# EAGLE design schematic (EAGLE 9.5.1)
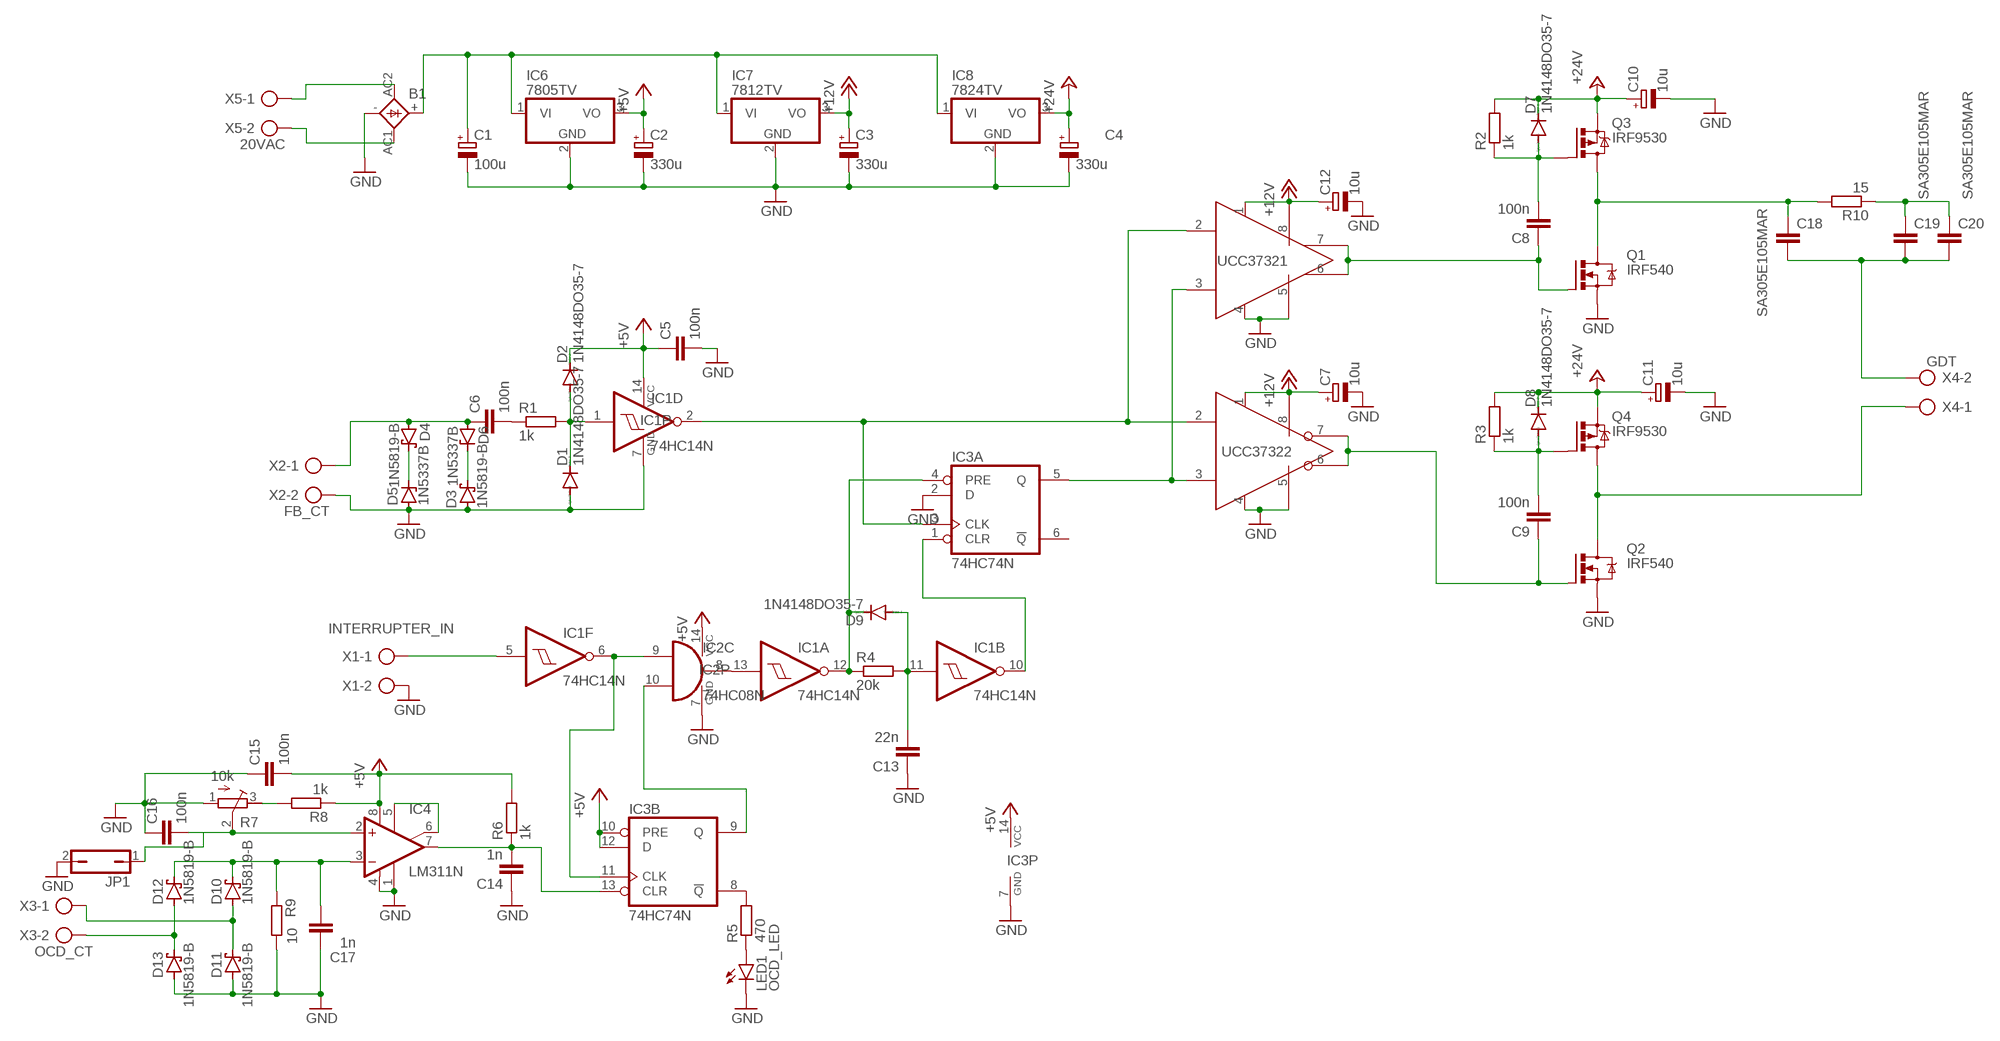
[diagram p0: schematic, sheet 1]

## Parts
B1  KBL  [KBL]
C1  100u  CPOL-EUE3.5-10  [E3,5-10]
C2  330u  CPOL-EUE3.5-10  [E3,5-10]
C3  330u  CPOL-EUE3.5-10  [E3,5-10]
C4  330u  CPOL-EUE3.5-10  [E3,5-10]
C5  100n  C-EU050-030X075  [C050-030X075]
C6  100n  C-EU050-030X075  [C050-030X075]
C7  10u  CPOL-EUE2.5-6  [E2,5-6]
C8  100n  C-EU050-030X075  [C050-030X075]
C9  100n  C-EU050-030X075  [C050-030X075]
C10  10u  CPOL-EUE2.5-6  [E2,5-6]
C11  10u  CPOL-EUE2.5-6  [E2,5-6]
C12  10u  CPOL-EUE2.5-6  [E2,5-6]
C13  22n  C-EU050-030X075  [C050-030X075]
C14  1n  C-EU050-030X075  [C050-030X075]
C15  100n  C-EU050-030X075  [C050-030X075]
C16  100n  C-EU050-030X075  [C050-030X075]
C17  1n  C-EU050-030X075  [C050-030X075]
C18  SA305E105MAR  C-EU050-025X075  [C050-025X075]
C19  SA305E105MAR  C-EU050-025X075  [C050-025X075]
C20  SA305E105MAR  C-EU050-025X075  [C050-025X075]
D1  1N4148DO35-7  [DO35-7]
D2  1N4148DO35-7  [DO35-7]
D3  1N5819-B  [DO41-7.6]
D4  1N5819-B  [DO41-7.6]
D5  1N5337B  ZENER-DIODEDO41Z10  [DO41Z10]
D6  1N5337B  ZENER-DIODEDO41Z10  [DO41Z10]
D7  1N4148DO35-7  [DO35-7]
D8  1N4148DO35-7  [DO35-7]
D9  1N4148DO35-7  [DO35-7]
D10  1N5819-B  [DO41-7.6]
D11  1N5819-B  [DO41-7.6]
D12  1N5819-B  [DO41-7.6]
D13  1N5819-B  [DO41-7.6]
IC1  74HC14N  [DIL14]
IC2  74HC08N  [DIL14]
IC3  74HC74N  [DIL14]
IC4  LM311N  [DIL08]
IC5  UCC37321DIL8  [DIL08]
IC6  7805TV  [TO220V]
IC7  7812TV  [TO220V]
IC8  7824TV  [TO220V]
IC9  UCC37322DIL8  [DIL08]
JP1  JP1Q  [JP1]
LED1  OCD_LED  LED3MM  [LED3MM]
Q1  IRF540  [TO220BV]
Q2  IRF540  [TO220BV]
Q3  IRF9530  [TO220BV]
Q4  IRF9530  [TO220BV]
R1  1k  R-EU_0204/7  [0204/7]
R2  1k  R-EU_0204/7  [0204/7]
R3  1k  R-EU_0204/7  [0204/7]
R4  20k  R-EU_0204/7  [0204/7]
R5  470  R-EU_0204/7  [0204/7]
R6  1k  R-EU_0204/7  [0204/7]
R7  10k  R-TRIMM64X  [RTRIM64X]
R8  1k  R-EU_0204/7  [0204/7]
R9  10  R-EU_0411/15  [0411/15]
R10  15  R-EU_0204/7  [0204/7]
X1  INTERRUPTER_IN  AK300/2  [AK300/2]
X2  FB_CT  AK300/2  [AK300/2]
X3  OCD_CT  AK300/2  [AK300/2]
X4  GDT  AK300/2  [AK300/2]
X5  20VAC  AK300/2  [AK300/2]

## Nets
+5V: C2.+ C5.1 C15.2 D2.C IC1.14(P:VCC) IC2.14(P:VCC) IC3.10(B:PRE) IC3.12(B:D) IC3.14(P:VCC) IC4.8(V+) IC6.3(VO) R6.2 R8.1
+12V: C3.+ C7.+ C12.+ IC5.1(1_VDD) IC5.8(8_VDD) IC7.3(VO) IC9.1(1_VDD) IC9.8(8_VDD)
+24V: C4.+ C10.+ C11.+ D7.C D8.C IC8.3(VO) Q3.S Q4.S R2.2 R3.2
GND: B1.- C1.- C2.- C3.- C4.- C5.2 C7.- C10.- C11.- C12.- C13.1 C14.1 C15.1 C16.1 C17.1 D1.A D3.A D5.A D11.A D13.A IC1.7(P:GND) IC2.7(P:GND) IC3.2(A:D) IC3.7(P:GND) IC4.1(GND) IC4.4(V-) IC5.4(4_AGND) IC5.5(5_PGND) IC6.2(GND) IC7.2(GND) IC8.2(GND) IC9.4(4_AGND) IC9.5(5_PGND) JP1.2 LED1.K(C) Q1.S Q2.S R7.1(A) R9.2 X1.2 X2.2
N$1: B1.+ C1.+ IC6.1(VI) IC7.1(VI) IC8.1(VI)
N$2: B1.AC2(AC1) X5.1
N$3: B1.AC1(AC2) X5.2
N$4: D1.C D2.A IC1.1(D:I) R1.2
N$5: C6.2 R1.1
N$6: C6.1 D4.A D6.A X2.1
N$7: D3.C D6.C
N$8: D4.C D5.C
N$9: IC1.2(D:O) IC3.3(A:CLK) IC5.2(2_IN) IC9.2(2_IN)
N$10: C8.1 IC5.6(6_OUT) IC5.7(7_OUT) Q1.G
N$11: IC3.5(A:Q) IC5.3(3_ENBL) IC9.3(3_ENBL)
N$12: C9.1 IC9.6(6_OUT) IC9.7(7_OUT) Q2.G
N$13: IC1.10(B:O) IC3.1(A:CLR)
N$14: C9.2 D8.A Q4.G R3.1
N$15: D9.C IC1.12(A:O) IC3.4(A:PRE) R4.1
N$16: C13.2 D9.A IC1.11(B:I) R4.2
N$17: C8.2 D7.A Q3.G R2.1
N$18: Q2.D Q4.D X4.1
N$19: C18.1 Q1.D Q3.D R10.2
N$20: IC1.13(A:I) IC2.8(C:O)
N$21: C19.1 C20.1 R10.1
N$22: IC2.10(C:I1) IC3.9(B:Q)
N$23: IC3.8(B:!Q) R5.2
N$24: LED1.A R5.1
N$25: IC1.6(F:O) IC2.9(C:I0) IC3.11(B:CLK)
N$26: IC4.5(ON) IC4.6(ON/STR)
N$27: C16.2 IC4.2(+IN) JP1.1 R7.2(S)
N$28: R7.3(E) R8.2
N$29: C17.2 D10.C D12.C IC4.3(-IN) R9.1
N$30: C14.2 IC3.13(B:CLR) IC4.7(OUT) R6.1
N$31: D10.A D11.C X3.1
N$32: D12.A D13.C X3.2
N$33: C18.2 C19.2 C20.2 X4.2
N$34: IC1.5(F:I) X1.1
Unconnected: IC1.3(E:I) IC1.4(E:O) IC1.8(C:O) IC1.9(C:I) IC2.1(A:I0) IC2.2(A:I1) IC2.3(A:O) IC2.4(B:I0) IC2.5(B:I1) IC2.6(B:O) IC2.11(D:O) IC2.12(D:I0) IC2.13(D:I1) IC3.6(A:!Q)

## Library data of the parts
B1 = rectifier:KBL: DIOTEC RECTIFIER
C1-C4 C7 C10-C12 = resistor:CPOL-EU: POLARIZED CAPACITOR, European symbol
C5 C6 C8 C9 C13-C17 = rcl:C-EU: CAPACITOR, European symbol; SPICEPREFIX: C
C18-C20 = resistor:C-EU: CAPACITOR, European symbol
D1 D2 D7-D9 = diode:1N4148: DIODE high speed (Philips)
D3 D4 D10-D13 = diode:1N581*: 1.0A SCHOTTKY BARRIER RECTIFIER Source: http://www.diodes.com/datasheets/ds23001.pdf
D5 D6 = diode:ZENER-DIODE: Z-Diode
IC1 = 74xx-eu:74*14: Hex schmitt trigger INVERTER
IC2 = 74xx-eu:74*08: Quad 2-input AND gate
IC3 = 74xx-eu:74*74: Dual D type positive edge triggered FLIP FLOP, preset and clear
IC4 = linear:LM311: COMPARATOR
IC5 = UCC37321:UCC37321: NonInverting 9A Mosfet Gate Diver with Enable; AVAILABILITY: Unavailable; DESCRIPTION: Low-Side Gate Driver IC Inverting 8-PDIP; MF: Texas Instruments; MP: UCC37321; PACKAGE: SOIC-8 Texas Instruments; PRICE: None
IC6-IC8 = linear:78*: Positive VOLTAGE REGULATOR Source: http://cache.national.com/ds/LM/LM78L05.pdf http://www.fairchildsemi.com/ds/LM/LM7805.pdf
IC9 = UCC37322:UCC37322: Inverting 9A Mosfet Gate Diver with Enable; AVAILABILITY: Unavailable; DESCRIPTION: Low-Side Gate Driver IC Non-Inverting 8-PDIP; MF: Texas Instruments; MP: UCC37322; PACKAGE: SOIC-8 Texas Instruments; PRICE: None
JP1 = jumper:JP1Q: JUMPER
LED1 = led:LED: LED OSRAM: - CHIPLED LG R971, LG N971, LY N971, LG Q971, LY Q971, LO R971, LY R971 LH N974, LH R974 LS Q976, LO Q976, LY Q976 LO Q996 - Hyper CHIPLED LW Q18S LB Q993, LB Q99A, LB R99A - SideLED LS A670, LO A670, LY A670, LG A670, LP A670 LB A673, LV A673, LT A673, LW A673 LH A674 LY A675 LS A676, LA A676, LO A676, LY A676, LW A676 LS A679, LY A679, LG A679 - Hyper Micro SIDELED® LS Y876, LA Y876, LO Y876, LY Y876 LT Y87S - SmartLED LW L88C, LW L88S LB L89C, LB L89S, LG L890 LS L89K, LO L89K, LY L89K LS L896, LA L896, LO L896, LY L896 - TOPLED LS T670, LO T670, LY T670, LG T670, LP T670 LSG T670, LSP T670, LSY T670, LOP T670, LYG T670 LG T671, LOG T671, LSG T671 LB T673, LV T673, LT T673, LW T673 LH T674 LS T676, LA T676, LO T676, LY T676, LB T676, LH T676, LSB T676, LW T676 LB T67C, LV T67C, LT T67C, LS T67K, LO T67K, LY T67K, LW E67C LS E67B, LA E67B, LO E67B, LY E67B, LB E67C, LV E67C, LT E67C LW T67C LS T679, LY T679, LG T679 LS T770, LO T770, LY T770, LG T770, LP T770 LB T773, LV T773, LT T773, LW T773 LH T774 LS E675, LA E675, LY E675, LS T675 LS T776, LA T776, LO T776, LY T776, LB T776 LHGB T686 LT T68C, LB T68C - Hyper Mini TOPLED® LB M676 - Mini TOPLED Santana® LG M470 LS M47K, LO M47K, LY M47K Source: http://www.osram.convergy.de LUXEON: - LUMILED® LXK2-PW12-R00, LXK2-PW12-S00, LXK2-PW14-U00, LXK2-PW14-V00 LXK2-PM12-R00, LXK2-PM12-S00, LXK2-PM14-U00 LXK2-PE12-Q00, LXK2-PE12-R00, LXK2-PE12-S00, LXK2-PE14-T00, LXK2-PE14-U00 LXK2-PB12-K00, LXK2-PB12-L00, LXK2-PB12-M00, LXK2-PB14-N00, LXK2-PB14-P00, LXK2-PB14-Q00 LXK2-PR12-L00, LXK2-PR12-M00, LXK2-PR14-Q00, LXK2-PR14-R00 LXK2-PD12-Q00, LXK2-PD12-R00, LXK2-PD12-S00 LXK2-PH12-R00, LXK2-PH12-S00 LXK2-PL12-P00, LXK2-PL12-Q00, LXK2-PL12-R00 Source: www.luxeon.com KINGBRIGHT: KA-3528ASYC Source: www.kingbright.com
Q1 Q2 = transistor-power:IRF540: HEXFET Power MOSFET
Q3 Q4 = transistor-power:IRF9530: P-CHANNEL HEXFET POWER-MOS-FET Source: http://www.irf.com/product-info/datasheets/data/irf9530.pdf
R1-R6 R8-R10 = resistor:R-EU_: RESISTOR, European symbol
R7 = resistor:R-TRIMM: Trimm resistor
X1-X5 = con-ptr500:AK300/2: CONNECTOR; OC_FARNELL: unknown; OC_NEWARK: unknown

## Board
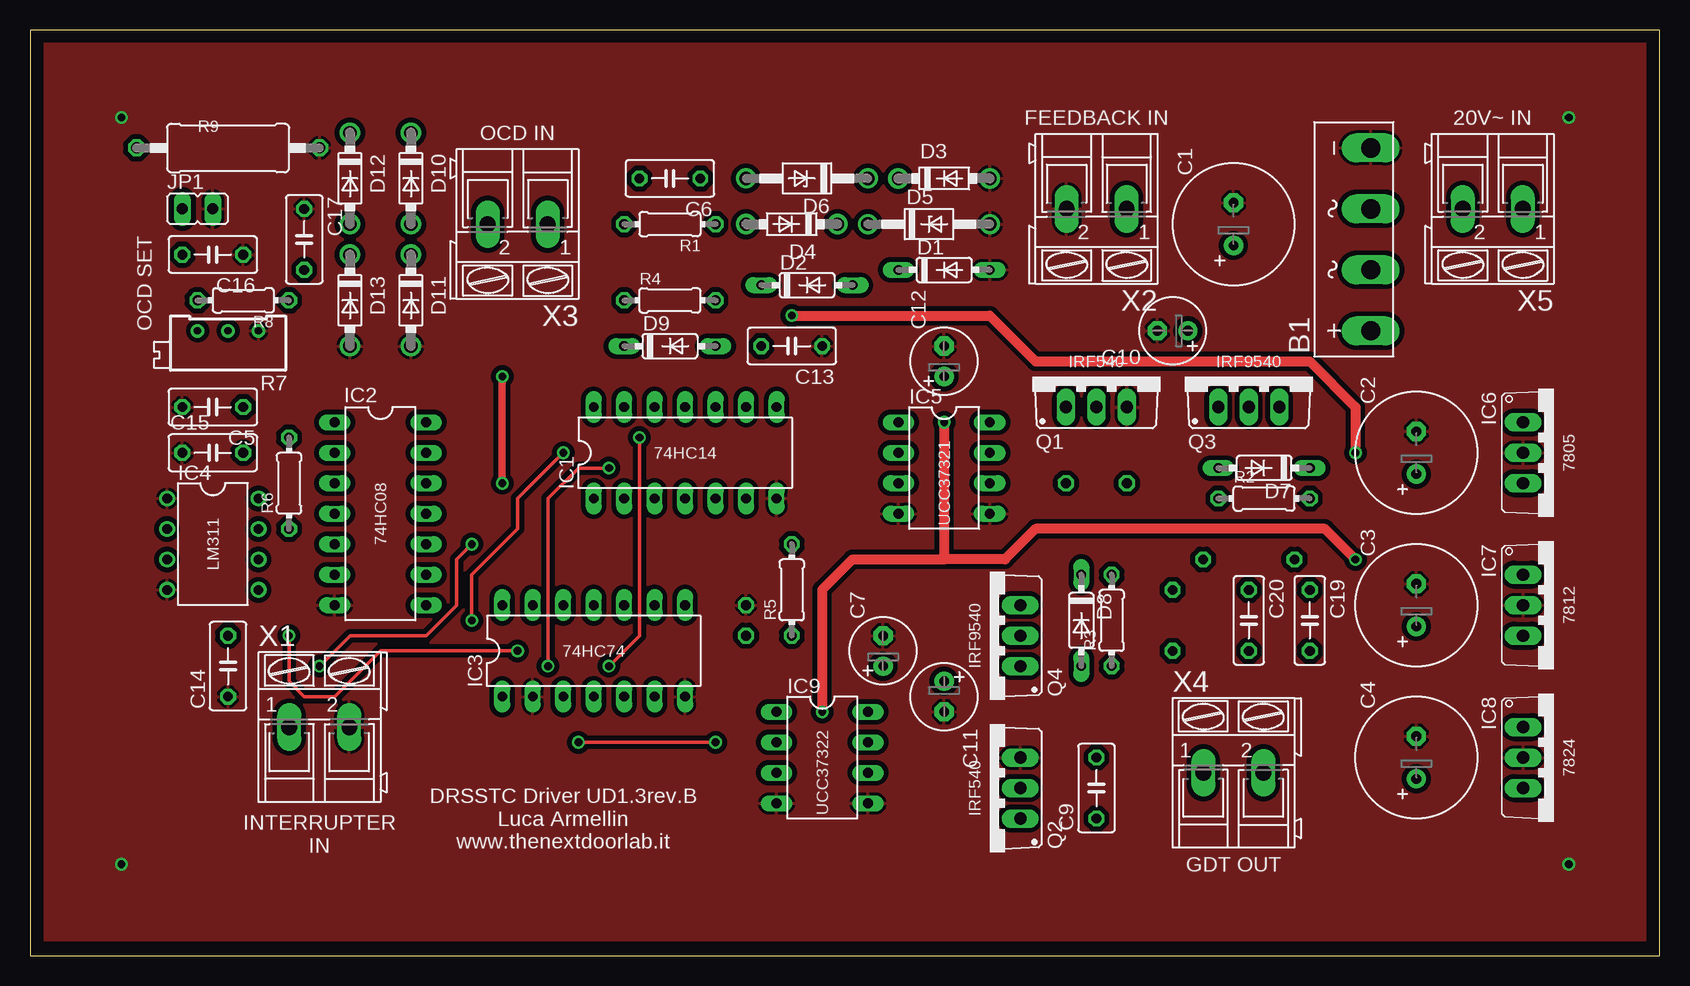
[diagram p1: board, top side]
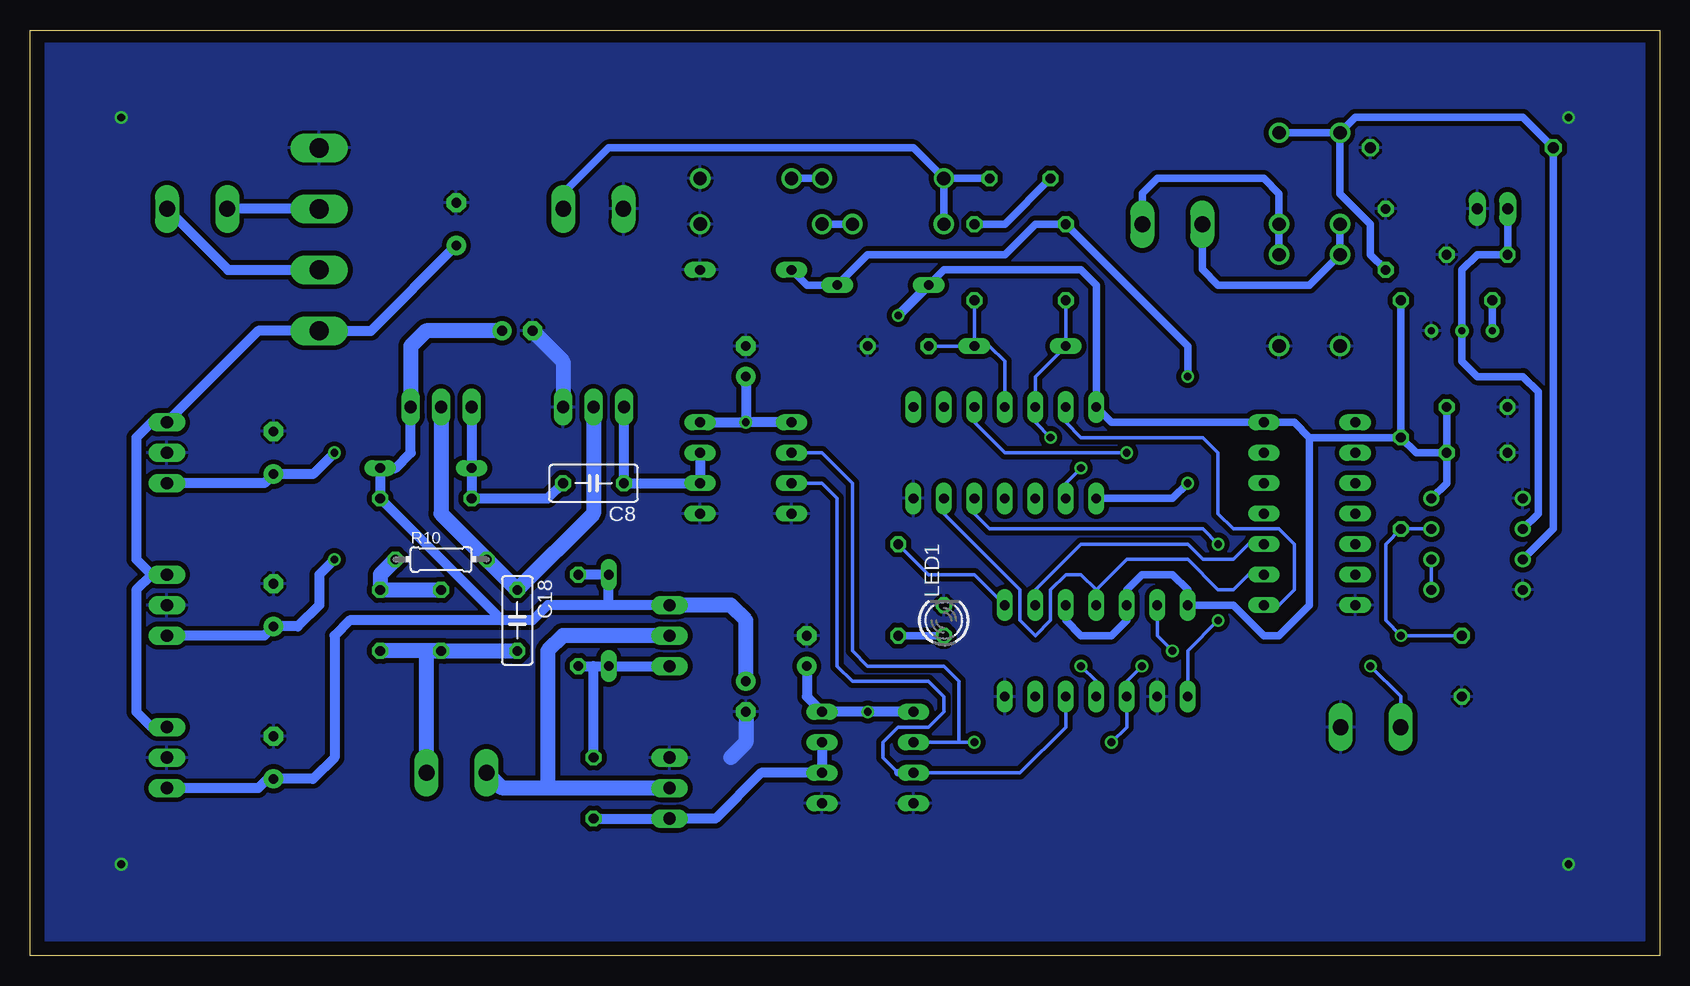
[diagram p2: board, bottom side, seen from below]

Size 135.87 x 77.14 mm. Coordinates in mm from the lower left corner, seen from the top.
Outline: 0,0 135.87,0 135.87,77.14 0,77.14 0,0
Copper layers (1*16): Top 0.035mm / dielectric 1.5mm / Bottom 0.035mm
Design rules "default": minimum track width 6mil, minimum drill 0.35mm, track to track 6mil, track to pad 6mil, pad to pad 6mil, via to via 6mil, smd to smd 6mil, copper to edge 40mil, drill to drill 6mil, minimum pad ring 10mil, minimum via ring 8mil, stop-mask expansion 4mil, vias tented up to drill 0mil, thermal gap 10mil

### Footprints (pad centres in the part's own frame; a part is rotated, then mirrored left to right if it is on the bottom)
KBL = drill 1.6 long: + -7.62,-1.27; - 7.62,-1.27; AC1 2.54,-1.27; AC2 -2.54,-1.27
E3,5-10 = drill 0.813 pad 1.6: + -1.778,0 | drill 0.813 pad 1.6 octagon: - 1.778,0
C050-030X075 = drill 0.813 octagon: 1 -2.54,0; 2 2.54,0
E2,5-6 = drill 0.813 pad 1.6: + -1.27,0 | drill 0.813 pad 1.6 octagon: - 1.27,0
C050-025X075 = drill 0.813 octagon: 1 -2.54,0; 2 2.54,0
DO35-7 = drill 0.813 long: A 3.81,0; C -3.81,0
DO41-7.6 = drill 1.1 pad 1.7: A 3.81,0; C -3.81,0
DO41Z10 = drill 1.118: A 5.08,0; C -5.08,0
DIL14 = drill 0.813 long: 1 -7.62,-3.81; 2 -5.08,-3.81; 3 -2.54,-3.81; 4 0,-3.81; 5 2.54,-3.81; 6 5.08,-3.81; 7 7.62,-3.81; 8 7.62,3.81; 9 5.08,3.81; 10 2.54,3.81; 11 0,3.81; 12 -2.54,3.81; 13 -5.08,3.81; 14 -7.62,3.81
DIL08 = drill 0.813 pad 1.27: 1 -3.81,-3.81; 2 -1.27,-3.81; 3 1.27,-3.81; 4 3.81,-3.81; 5 3.81,3.81; 6 1.27,3.81; 7 -1.27,3.81; 8 -3.81,3.81
DIL08' = drill 0.813 long: 1 -3.81,-3.81; 2 -1.27,-3.81; 3 1.27,-3.81; 4 3.81,-3.81; 5 3.81,3.81; 6 1.27,3.81; 7 -1.27,3.81; 8 -3.81,3.81
TO220V = drill 1.016 long: 1 -2.54,-2.54; 2 0,-2.54; 3 2.54,-2.54
JP1 = drill 0.914 long: 1 0,-1.27; 2 0,1.27
LED3MM = drill 0.813 octagon: A -1.27,0; K 1.27,0
TO220BV = drill 1.016 long: D 0,-2.54; G -2.54,-2.54; S 2.54,-2.54
0204/7 = drill 0.813 octagon: 1 -3.81,0; 2 3.81,0
RTRIM64X = drill 0.61: 1 1.27,-2.54; 2 1.27,0; 3 1.27,2.54
0411/15 = drill 0.914 octagon: 1 -7.62,0; 2 7.62,0
AK300/2 = drill 1.321 long: 1 -2.515,0; 2 2.489,0

### Placement (x,y rotation side)
B1  110.49,59.69 90 top
C1  100.33,60.96 90 top
C2  115.57,41.91 90 top
C3  115.57,29.21 90 top
C4  115.57,16.51 90 top
C5  15.24,45.72 180 top
C6  53.34,64.77 180 top
C7  71.12,25.4 90 top
C8  88.9,39.37 180 bottom
C9  88.9,13.97 90 top
C10  95.25,52.07 180 top
C11  76.2,21.59 270 top
C12  76.2,49.53 90 top
C13  63.5,50.8 180 top
C14  16.51,24.13 90 top
C15  15.24,41.91 0 top
C16  15.24,58.42 180 top
C17  22.86,59.69 270 top
C18  95.25,27.94 270 bottom
C19  106.68,27.94 270 top
C20  101.6,27.94 270 top
D1  76.2,57.15 0 top
D2  64.77,55.88 0 top
D3  76.2,64.77 0 top
D4  63.5,60.96 180 top
D5  74.93,60.96 0 top
D6  64.77,64.77 180 top
D7  102.87,40.64 180 top
D8  87.63,27.94 270 top
D9  53.34,50.8 0 top
D10  31.75,64.77 270 top
D11  31.75,54.61 270 top
D12  26.67,64.77 270 top
D13  26.67,54.61 270 top
IC1  54.61,41.91 0 top
IC2  29.21,36.83 270 top
IC3  46.99,25.4 0 top
IC4  15.24,34.29 270 top
IC5  UCC37321DIL8  [DIL08']  76.2,40.64 270 top
IC6  127,41.91 270 top
IC7  127,29.21 270 top
IC8  127,16.51 270 top
IC9  UCC37322DIL8  [DIL08']  66.04,16.51 270 top
JP1  13.97,62.23 270 top
LED1  59.69,27.94 90 bottom
Q1  88.9,48.26 0 top
Q2  80.01,13.97 90 top
Q3  101.6,48.26 0 top
Q4  80.01,26.67 90 top
R1  53.34,60.96 180 top
R2  102.87,38.1 0 top
R3  90.17,27.94 90 top
R4  53.34,54.61 0 top
R5  63.5,30.48 90 top
R6  21.59,39.37 90 top
R7  16.51,50.8 90 top
R8  17.78,54.61 180 top
R9  16.51,67.31 0 top
R10  101.6,33.02 0 bottom
X1  24.13,19.05 0 top
X2  88.9,62.23 180 top
X3  40.64,60.96 180 top
X4  100.33,15.24 0 top
X5  121.92,62.23 180 top

### Tracks (layer width: path | path; a pad name or v marks a point on that pad's centre or on a via)
+5V  (via drill 0.65)
  Top 0.813: v63.5,53.34 80.01,53.34 83.82,49.53 106.68,49.53 110.49,45.72 v110.49,41.91
  Bottom 0.61: IC3.10 49.53,27.94 48.26,26.67 45.72,26.67 44.45,27.94 IC3.12 44.45,30.48 43.18,31.75 40.64,31.75 39.37,30.48 IC3.14 35.56,29.21 33.02,26.67 31.75,26.67 29.21,29.21 29.21,43.18 | 29.21,43.18 30.48,44.45 IC2.14 45.72,44.45 IC1.14 46.99,55.88 48.26,57.15 59.69,57.15 D2.C | C15.2 17.78,39.37 IC4.8 | C15.2 20.32,41.91 R6.2 | 29.21,43.18 R6.2 | C5.1 C15.2 | R8.1 R6.2
  Bottom 0.813: IC6.3 116.33,39.37 C2.+ 112.27,40.13 v110.49,41.91 | D2.C v63.5,53.34
+12V  (via drill 0.65)
  Top 0.813: v110.49,33.02 107.95,35.56 83.82,35.56 81.28,33.02 76.2,33.02 | v66.04,20.32 66.04,30.48 68.58,33.02 76.2,33.02 | v76.2,44.45 76.2,33.02
  Bottom 0.813: IC9.1 v66.04,20.32 IC9.8 71.12,21.59 C7.+ | IC7.3 116.33,26.67 C3.+ 113.54,27.43 111.76,29.21 111.76,31.75 v110.49,33.02 | IC5.1 v76.2,44.45 | IC5.8 v76.2,44.45 | C12.+ v76.2,44.45
+24V
  Bottom 0.61: C4.+ 116.08,14.73
  Bottom 0.813: Q4.S 87.63,29.21 | 87.63,29.21 D8.C R3.2 | Q3.S 104.14,41.91 105.41,40.64 D7.C R2.2 96.52,27.94 | 87.63,29.21 92.71,29.21 93.98,27.94 96.52,27.94 | 116.08,14.73 116.84,13.97 IC8.3 | 96.52,27.94 109.22,27.94 110.49,26.67 110.49,16.51 112.27,14.73 C4.+
  Bottom 1.27: Q4.S 77.47,29.21 76.2,27.94 C11.+ | C10.+ 102.87,52.07 104.14,50.8 Q3.S
GND  (via drill 0.65)
  Bottom 1.27: C11.- 76.2,17.78 77.47,16.51 | C10.- 91.44,49.53 Q1.S
  other vias: 7.62,69.85 7.62,7.62 128.27,7.62 128.27,69.85
  pour Bottom (isolate 0.406): 1.27,76.2 134.62,76.2 134.62,1.27 1.27,1.27
  pour Top (isolate 0.406): 1.27,76.2 134.62,76.2 134.62,1.27 1.27,1.27
N$1
  Bottom 0.61: 125.73,19.05 IC8.1
  Bottom 0.813: C1.+ 107.44,52.07 B1.+ 116.84,52.07 IC6.1 125.73,44.45 127,43.18 127,33.02 125.73,31.75 | 125.73,31.75 IC7.1 | 125.73,31.75 127,30.48 127,20.32 125.73,19.05
N$2
  Bottom 0.813: X5.1 119.36,57.15 B1.AC2
N$3
  Bottom 0.813: B1.AC1 X5.2
N$4  (via drill 0.65)
  Top 0.61: v39.37,39.37 v39.37,48.26
  Bottom 0.61: IC1.1 40.64,38.1 v39.37,39.37 | D1.C 71.12,55.88 D2.A 66.04,58.42 54.61,58.42 52.07,60.96 R1.2 39.37,50.8 v39.37,48.26
N$5
  Bottom 0.61: C6.2 54.61,60.96 R1.1
N$6
  Bottom 0.61: C6.1 D6.A | D6.A D4.A | D6.A 62.23,67.31 87.63,67.31 91.42,63.53 X2.1
N$7
  Bottom 0.61: D6.C D3.C
N$8
  Bottom 0.61: D4.C D5.C
N$9  (via drill 0.65)
  Top 0.305: v57.15,17.78 v45.72,17.78 | v43.18,24.13 43.18,38.1 45.72,40.64 v48.26,40.64
  Bottom 0.305: IC5.2 69.85,41.91 67.31,39.37 67.31,25.4 66.04,24.13 59.69,24.13 58.42,22.86 58.42,17.78 | IC9.2 58.42,17.78 | 58.42,17.78 v57.15,17.78 | v45.72,17.78 44.45,19.05 IC3.3 44.45,22.86 v43.18,24.13 | v48.26,40.64 49.53,39.37 IC1.2
N$10
  Bottom 0.813: Q1.G C8.1 IC5.6 IC5.7
N$11
  Bottom 0.305: IC5.3 69.85,39.37 68.58,38.1 68.58,24.13 67.31,22.86 60.96,22.86 59.69,21.59 59.69,20.32 60.96,19.05 63.5,19.05 64.77,17.78 64.77,16.51 63.5,15.24 | IC3.5 49.53,19.05 53.34,15.24 IC9.3
  Bottom 0.61: 63.5,15.24 IC9.3
N$12
  Bottom 0.813: C9.1 Q2.G 78.74,11.43 74.93,15.24 IC9.6 IC9.7
N$13  (via drill 0.65)
  Top 0.305: v44.45,41.91 40.64,38.1 40.64,35.56 36.83,31.75 v36.83,27.94
  Bottom 0.305: IC1.10 57.15,44.45 54.61,41.91 v44.45,41.91 | IC3.1 39.37,25.4 v36.83,27.94
N$14
  Bottom 0.813: R3.1 88.9,24.13 | 88.9,24.13 D8.A Q4.G | C9.2 88.9,24.13
N$15  (via drill 0.65)
  Top 0.305: v48.26,24.13 50.8,26.67 v50.8,43.18
  Bottom 0.305: R4.1 D9.C 52.07,48.26 IC1.12 52.07,44.45 v50.8,43.18 | v48.26,24.13 46.99,22.86 IC3.4
N$16
  Bottom 0.305: R4.2 D9.A | C13.2 D9.A | D9.A 55.88,50.8 54.61,49.53 IC1.11
N$17
  Bottom 0.813: Q3.G D7.A R2.1 92.71,38.1 C8.2
N$18
  Bottom 0.61: 82.58,13.99 Q2.D
  Bottom 1.27: X4.1 96.57,13.99 92.71,13.99 | 92.71,13.99 82.58,13.99 | Q4.D 91.44,26.67 92.71,25.4 92.71,13.99
N$19
  Bottom 1.27: Q1.D 88.9,36.83 C18.1 R10.2 101.6,36.83 Q3.D
N$20
  Bottom 0.305: IC2.8 31.75,29.21 30.48,30.48 30.48,34.29 31.75,35.56 35.56,35.56 36.83,36.83 36.83,41.91 38.1,43.18 48.26,43.18 49.53,44.45 IC1.13
N$21
  Bottom 1.27: C20.1 C19.1 106.68,31.75 R10.1
N$22
  Bottom 0.305: IC3.9 52.07,30.48 48.26,34.29 39.37,34.29 38.1,33.02 35.56,33.02 34.29,34.29 IC2.10
N$23
  Bottom 0.305: R5.2 60.96,31.75 57.15,31.75 IC3.8
N$24
  Bottom 0.61: R5.1 LED1.A
N$25
  Bottom 0.305: IC1.6 59.69,36.83 53.34,30.48 53.34,27.94 52.07,26.67 50.8,27.94 50.8,30.48 49.53,31.75 48.26,31.75 46.99,30.48 | IC3.11 46.99,30.48 | 46.99,30.48 44.45,33.02 39.37,33.02 36.83,30.48 35.56,30.48 34.29,31.75 IC2.9
N$26
  Bottom 0.305: IC4.6 IC4.5
N$27
  Bottom 0.61: IC4.2 10.16,36.83 10.16,46.99 11.43,48.26 15.24,48.26 16.51,49.53 R7.2 16.51,57.15 15.24,58.42 C16.2 JP1.1
N$28
  Bottom 0.61: R8.2 R7.3
N$29
  Bottom 0.61: D12.C 26.67,63.5 24.13,60.96 24.13,58.42 C17.2 | D12.C 25.4,69.85 11.43,69.85 R9.1 8.89,35.56 IC4.3 | D12.C D10.C
N$30  (via drill 0.65)
  Top 0.305: v40.64,25.4 29.21,25.4 25.4,21.59 22.86,21.59 21.59,22.86 v21.59,26.67
  Bottom 0.305: IC3.13 41.91,26.67 v40.64,25.4 | C14.2 v21.59,26.67 22.86,27.94 22.86,34.29 R6.1 IC4.7
N$31
  Bottom 0.61: X3.1 43.16,63.53 41.91,64.77 33.02,64.77 31.75,63.5 D10.A D11.C
N$32
  Bottom 0.61: D12.A D13.C 29.21,55.88 36.83,55.88 38.15,57.2 X3.2
N$33
  Bottom 1.27: X4.2 102.82,25.38 102.87,25.4 C20.2 | C20.2 C19.2 | C20.2 C18.2
N$34  (via drill 0.65)
  Top 0.305: v36.83,34.29 35.56,33.02 35.56,29.21 33.02,26.67 26.67,26.67 v24.13,24.13
  Bottom 0.305: IC1.5 57.15,36.83 55.88,35.56 38.1,35.56 v36.83,34.29 | v24.13,24.13 21.61,21.62 X1.1

### Text on the board
tPlace: FEEDBACK IN | 20V~ IN | OCD IN | OCD SET | IRF540 | IRF9540 | 74HC14 | 7805 | UCC37321 | 74HC08 | LM311 | 7812 | IRF9540 | 74HC74 | 7824 | UCC37322 | IRF540 | DRSSTC Driver UD1.3rev.B / Luca Armellin / www.thenextdoorlab.it | INTERRUPTER / IN | GDT OUT